# Altium schematic sheet MCU main_2.SchDoc: MAIN MCU 2
size A3; Date: 18 11 2014; Author: Rachid AKKOUCHE; CompanyName: MDI; DrawnBy: Rachid AKKOUCHE; Engineer: Rachid AKKOUCHE; Organization: RASoftware; Address1: 52-J03 rue de la crèche; Address2: 7710 MEAUX; DocumentNumber: BRA2013083002D; Revision: 3; SheetNumber: 2; SheetTotal: 11; Time: 01:38; ProjectName: CERES
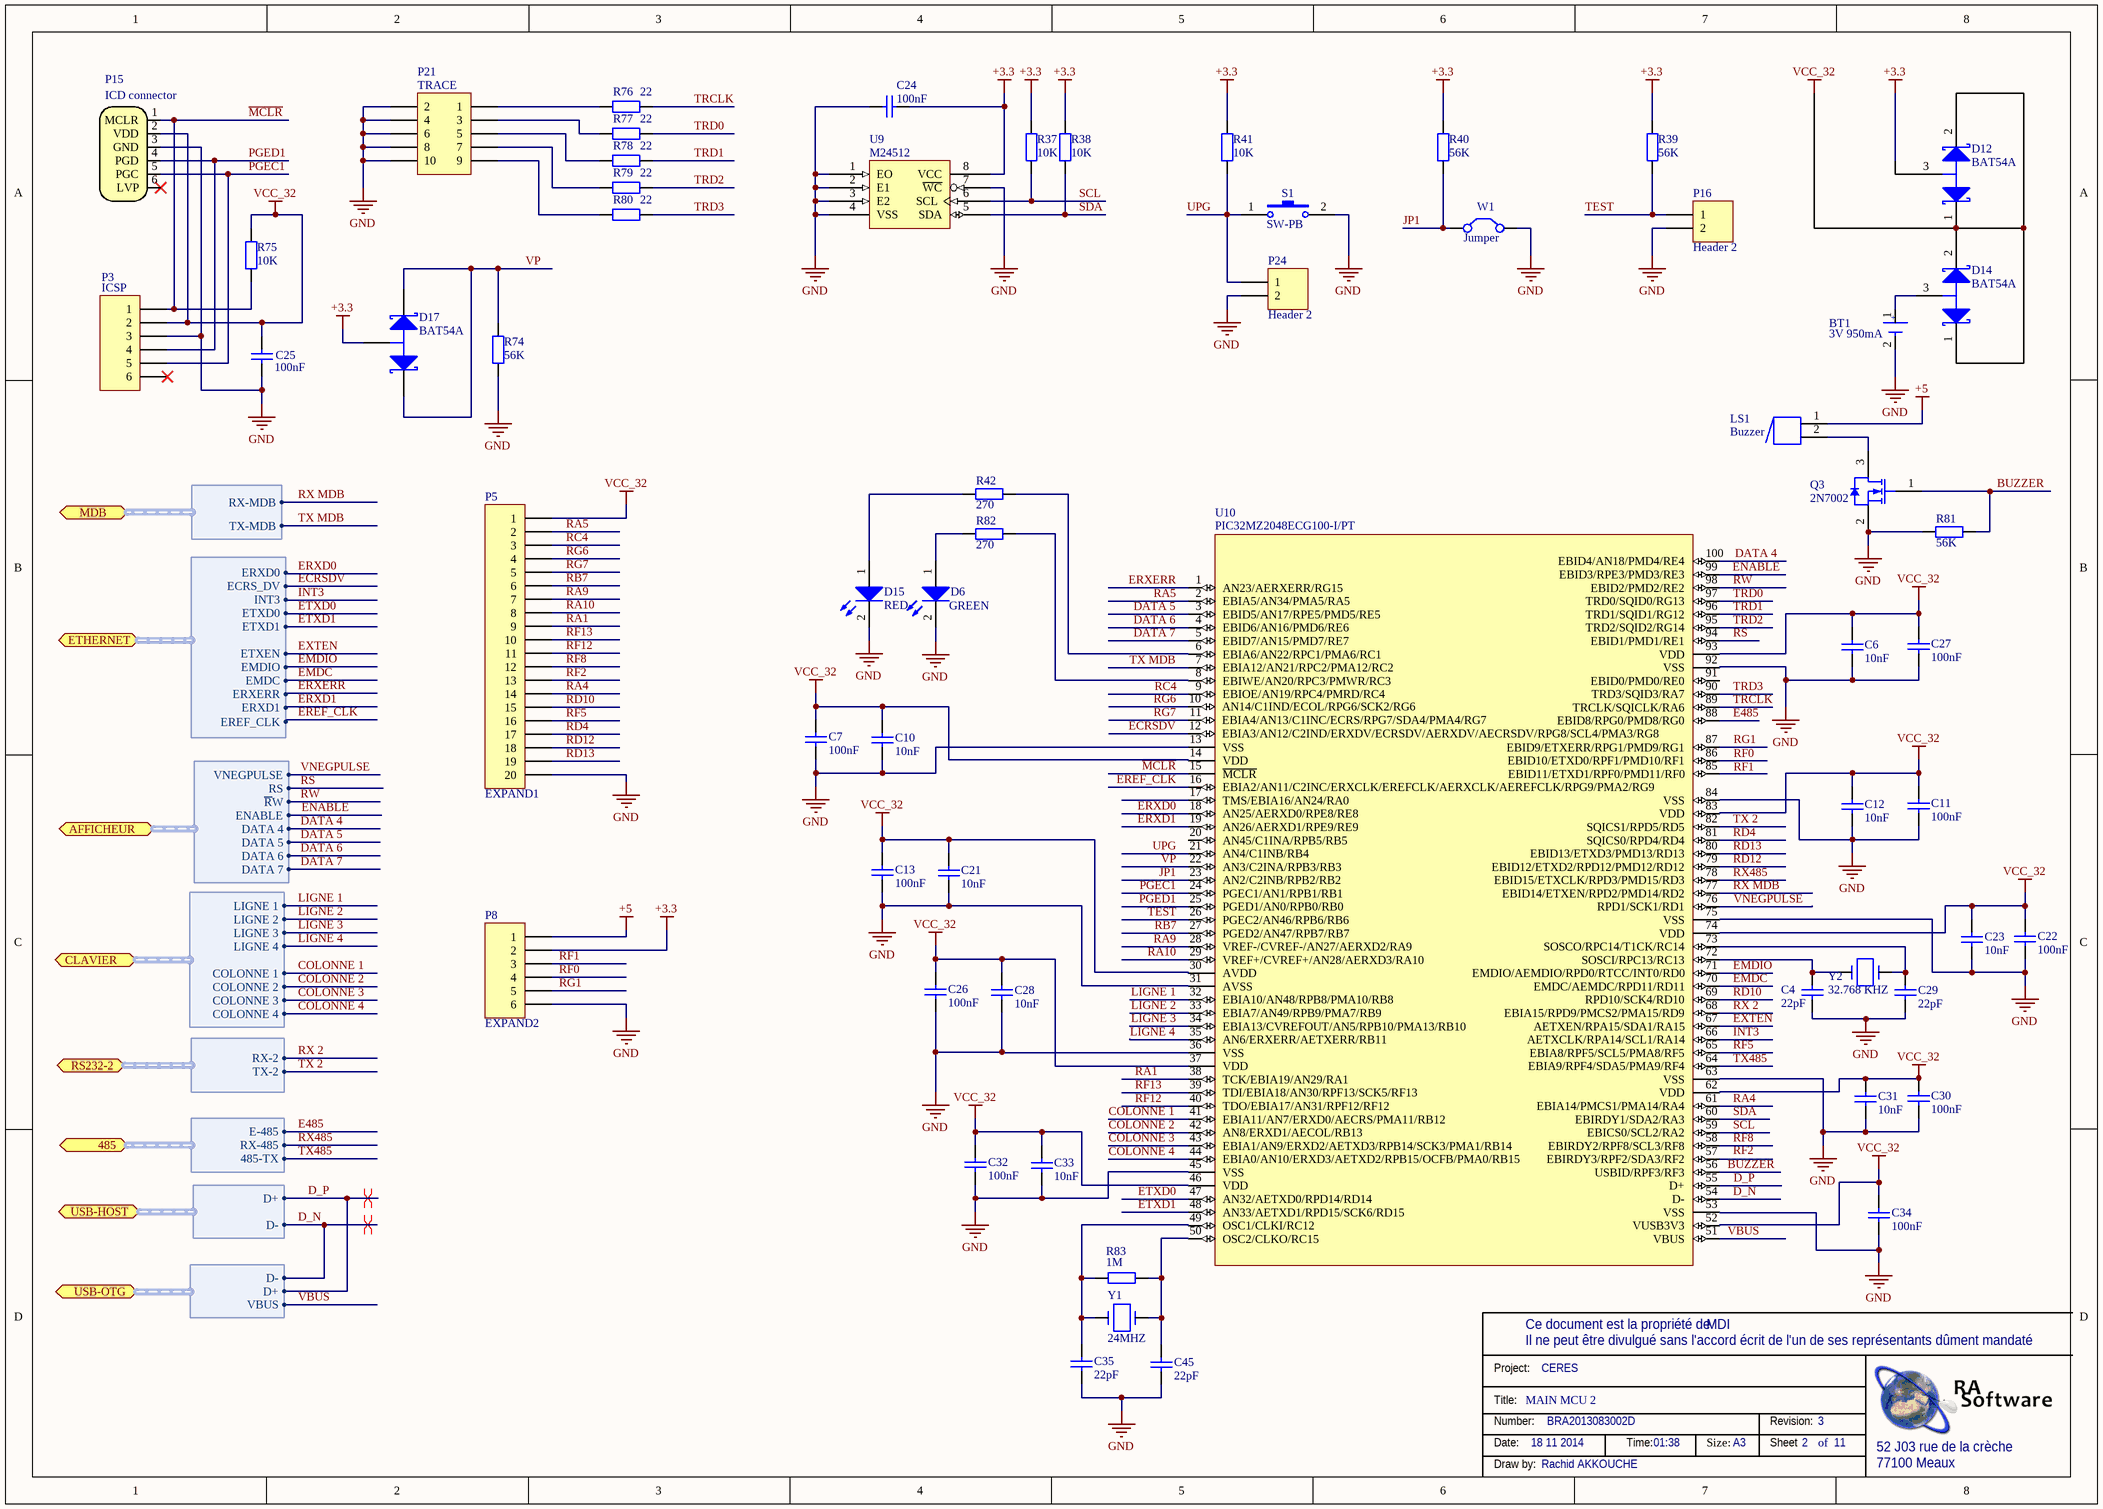
[diagram p0: MCU main_2.SchDoc]

## Parts
BT1  3V 950mA  [CR2477+SMTU]
C4  22pF  [C0805]
C6  10nF  [C0805]
C7  100nF  [C0805]
C10  10nF  [C0805]
C11  100nF  [C0805]
C12  10nF  [C0805]
C13  100nF  [C0805]
C21  10nF  [C0805]
C22  100nF  [C0805]
C23  10nF  [C0805]
C24  100nF  [C0805]
C25  100nF  [C0805]
C26  100nF  [C0805]
C27  100nF  [C0805]
C28  10nF  [C0805]
C29  22pF  [C0805]
C30  100nF  [C0805]
C31  10nF  [C0805]
C32  100nF  [C0805]
C33  10nF  [C0805]
C34  100nF  [C0805]
C35  22pF  [C0805]
C45  22pF  [C0805]
D6  Couleur: GREEN  [0603-LEDR]  (hidden comment: HSMG-C191)
D12  BAT54A  [SOT23]
D14  BAT54A  [SOT23]
D15  Couleur: RED  [0603-LEDR]  (hidden comment: HSMH-C190)
D17  BAT54A  [SOT23]
LS1  Buzzer  [Buzzer ABI-017-RC]
P3  M20-8770642  [M20_1X6]  (value not drawn)
P5  EXPAND1  [M20-2X10]
P8  EXPAND2  [M20_1X6]
P15  ICD connector  [TC2030]  (no BOM)
P16  Header 2  [M20_1X2]
P21  M20-8760542  [HE10_10PTS_CMS]  (value not drawn)
P24  Header 2  [M20_1X2]
Q3  2N7002  [SOT23]
R37  10K  [R0805]
R38  10K  [R0805]
R39  56K  [R0805]
R40  56K  [R0805]
R41  10K  [R0805]
R42  270  [R0805]
R74  56K  [R0805]
R75  10K  [R0805]
R76  22  [R0805]
R77  22  [R0805]
R78  22  [R0805]
R79  22  [R0805]
R80  22  [R0805]
R81  56K  [R0805]
R82  270  [R0805]
R83  1M  [R0805]
S1  SW-PB  [EVQQ2Y03W]
U9  M24512  [SOIC8]
U10  PIC32MZ2048ECG100-I/PT  [TQFP100pt]
W1  Jumper  [M20_1X2]
Y1  24MHZ  [HC49SD]
Y2  32.768 KHZ  [86SMX]

## Ports
485 (harness EIA-485), AFFICHEUR (harness IO DISPLAY), CLAVIER (harness KEYBOARD), ETHERNET (harness ETHERNET), MDB (harness MDB), RS232-2 (harness RS232_2), USB-HOST (harness USB-HOST), USB-OTG (harness USG-OTG)

## Harnesses
ETHERNET: ETXEN, ETXD0, ETXD1, INT3, EMDIO, EMDC, ECRS_DV, ERXERR, ERXD0, ERXD1, EREF_CLK
KEYBOARD: COLONNE 1, COLONNE 2, COLONNE 3, COLONNE 4, LIGNE 1, LIGNE 2, LIGNE 3, LIGNE 4
MDB: TX-MDB, RX-MDB
RS232_2: TX-2, RX-2
EIA-485: 485-TX, RX-485, E-485
USB-HOST: D-, D+
USG-OTG: D-, D+, VBUS
IO DISPLAY: DATA 4, DATA 5, DATA 6, DATA 7, ENABLE, ~{R}W, RS, VNEGPULSE

## Nets
+3.3: C24.1 D12.3(A) D17.3(A) P8.2 R37.2 R38.2 R39.2 R40.2 R41.2 U9.8(VCC)
+5: LS1.1 P8.1
GND: BT1.2 C4.2 C6.1 C7.1 C10.1 C11.1 C12.1 C13.1 C21.1 C22.1 C23.1 C24.2 C25.1 C26.1 C27.1 C28.1 C29.2 C30.1 C31.1 C32.1 C33.1 C34.1 C35.2 C45.2 D6.2(K) D15.2(K) P3.3 P5.20 P8.6 P15.3(GND) P16.2 P21.2 P21.4 P21.6 P21.8 P21.10 P24.2 Q3.2(S) R74.1 R81.1 S1.2 U9.1(EO) U9.2(E1) U9.3(E2) U9.4(VSS) U9.7(~{WC}) U10.13(VSS) U10.31(AVSS) U10.36(VSS) U10.45(VSS) U10.53(VSS) U10.63(VSS) U10.75(VSS) U10.84(VSS) U10.92(VSS) W1.2(C2)
VCC_32: C6.2 C7.2 C10.2 C11.2 C12.2 C13.2 C21.2 C22.2 C23.2 C25.2 C26.2 C27.2 C28.2 C30.2 C31.2 C32.2 C33.2 C34.2 D12.1(K1) D12.2(K2) D14.1(K1) D14.2(K2) P3.2 P5.1 P15.2(VDD) R75.2 U10.14(VDD) U10.30(AVDD) U10.37(VDD) U10.46(VDD) U10.52(VUSB3V3) U10.62(VDD) U10.74(VDD) U10.83(VDD) U10.93(VDD)
BUZZER: Q3.1(G) R81.2 U10.56(USBID/RPF3/RF3)
COLONNE 1: U10.41(EBIA11/AN7/ERXD0/AECRS/PMA11/RB12) ; port CLAVIER.COLONNE 1
COLONNE 2: U10.42(AN8/ERXD1/AECOL/RB13) ; port CLAVIER.COLONNE 2
COLONNE 3: U10.43(EBIA1/AN9/ERXD2/AETXD3/RPB14/SCK3/PMA1/RB14) ; port CLAVIER.COLONNE 3
COLONNE 4: U10.44(EBIA0/AN10/ERXD3/AETXD2/RPB15/OCFB/PMA0/RB15) ; port CLAVIER.COLONNE 4
D_N: U10.54(D-) ; port USB-HOST.D-, port USB-OTG.D-
D_P: U10.55(D+) ; port USB-HOST.D+, port USB-OTG.D+
DATA 4: U10.100(EBID4/AN18/PMD4/RE4) ; port AFFICHEUR.DATA 4
DATA 5: U10.3(EBID5/AN17/RPE5/PMD5/RE5) ; port AFFICHEUR.DATA 5
DATA 6: U10.4(EBID6/AN16/PMD6/RE6) ; port AFFICHEUR.DATA 6
DATA 7: U10.5(EBID7/AN15/PMD7/RE7) ; port AFFICHEUR.DATA 7
E485: U10.88(EBID8/RPG0/PMD8/RG0) ; port 485.E-485
ECRSDV: U10.12(EBIA3/AN12/C2IND/ERXDV/ECRSDV/AERXDV/AECRSDV/RPG8/SCL4/PMA3/RG8) ; port ETHERNET.ECRS_DV
EMDC: U10.70(EMDC/AEMDC/RPD11/RD11) ; port ETHERNET.EMDC
EMDIO: U10.71(EMDIO/AEMDIO/RPD0/RTCC/INT0/RD0) ; port ETHERNET.EMDIO
ENABLE: U10.99(EBID3/RPE3/PMD3/RE3) ; port AFFICHEUR.ENABLE
EREF_CLK: U10.16(EBIA2/AN11/C2INC/ERXCLK/EREFCLK/AERXCLK/AEREFCLK/RPG9/PMA2/RG9) ; port ETHERNET.EREF_CLK
ERXD0: U10.18(AN25/AERXD0/RPE8/RE8) ; port ETHERNET.ERXD0
ERXD1: U10.19(AN26/AERXD1/RPE9/RE9) ; port ETHERNET.ERXD1
ERXERR: U10.1(AN23/AERXERR/RG15) ; port ETHERNET.ERXERR
ETXD0: U10.47(AN32/AETXD0/RPD14/RD14) ; port ETHERNET.ETXD0
ETXD1: U10.48(AN33/AETXD1/RPD15/SCK6/RD15) ; port ETHERNET.ETXD1
EXTEN: U10.67(AETXEN/RPA15/SDA1/RA15) ; port ETHERNET.ETXEN
INT3: U10.66(AETXCLK/RPA14/SCL1/RA14) ; port ETHERNET.INT3
JP1: R40.1 U10.23(AN2/C2INB/RPB2/RB2) W1.1(C1)
LIGNE 1: U10.32(EBIA10/AN48/RPB8/PMA10/RB8) ; port CLAVIER.LIGNE 1
LIGNE 2: U10.33(EBIA7/AN49/RPB9/PMA7/RB9) ; port CLAVIER.LIGNE 2
LIGNE 3: U10.34(EBIA13/CVREFOUT/AN5/RPB10/PMA13/RB10) ; port CLAVIER.LIGNE 3
LIGNE 4: U10.35(AN6/ERXERR/AETXERR/RB11) ; port CLAVIER.LIGNE 4
~{MCLR}: P3.1 P15.1(MCLR) R75.1 U10.15(~{MCLR})
PGEC1: P3.5 P15.5(PGC) U10.24(PGEC1/AN1/RPB1/RB1)
PGED1: P3.4 P15.4(PGD) U10.25(PGED1/AN0/RPB0/RB0)
~{R}W: U10.98(EBID2/PMD2/RE2) ; port AFFICHEUR.~{R}W
RA1: P5.9 U10.38(TCK/EBIA19/AN29/RA1)
RA4: P5.14 U10.61(EBIA14/PMCS1/PMA14/RA4)
RA5: P5.2 U10.2(EBIA5/AN34/PMA5/RA5)
RA9: P5.7 U10.28(VREF-/CVREF-/AN27/AERXD2/RA9)
RA10: P5.8 U10.29(VREF+/CVREF+/AN28/AERXD3/RA10)
RB7: P5.6 U10.27(PGED2/AN47/RPB7/RB7)
RC4: P5.3 U10.9(EBIOE/AN19/RPC4/PMRD/RC4)
RD4: P5.17 U10.81(SQICS0/RPD4/RD4)
RD10: P5.15 U10.69(RPD10/SCK4/RD10)
RD12: P5.18 U10.79(EBID12/ETXD2/RPD12/PMD12/RD12)
RD13: P5.19 U10.80(EBID13/ETXD3/PMD13/RD13)
RF0: P8.4
RF1: P8.3
RF2: P5.13
RF5: P5.16 U10.65(EBIA8/RPF5/SCL5/PMA8/RF5)
RF8: P5.12 U10.58(EBIRDY2/RPF8/SCL3/RF8)
RF12: P5.11 U10.40(TDO/EBIA17/AN31/RPF12/RF12)
RF13: P5.10 U10.39(TDI/EBIA18/AN30/RPF13/SCK5/RF13)
RG1: P8.5 U10.87(EBID9/ETXERR/RPG1/PMD9/RG1)
RG6: P5.4 U10.10(AN14/C1IND/ECOL/RPG6/SCK2/RG6)
RG7: P5.5 U10.11(EBIA4/AN13/C1INC/ECRS/RPG7/SDA4/PMA4/RG7)
RS: U10.94(EBID1/PMD1/RE1) ; port AFFICHEUR.RS
RX485: U10.78(EBID15/ETXCLK/RPD3/PMD15/RD3) ; port 485.RX-485
RX 2: U10.68(EBIA15/RPD9/PMCS2/PMA15/RD9) ; port RS232-2.RX-2
RX MDB: U10.77(EBID14/ETXEN/RPD2/PMD14/RD2) ; port MDB.RX-MDB
SCL: R37.1 U9.6(SCL) U10.59(EBICS0/SCL2/RA2)
SDA: R38.1 U9.5(SDA) U10.60(EBIRDY1/SDA2/RA3)
TEST: P16.1 R39.1 U10.26(PGEC2/AN46/RPB6/RB6)
TRCLK: R76.1 U10.89(TRCLK/SQICLK/RA6)
TRD0: R77.1 U10.97(TRD0/SQID0/RG13)
TRD1: R78.1 U10.96(TRD1/SQID1/RG12)
TRD2: R79.1 U10.95(TRD2/SQID2/RG14)
TRD3: R80.1 U10.90(TRD3/SQID3/RA7)
TX485: U10.64(EBIA9/RPF4/SDA5/PMA9/RF4) ; port 485.485-TX
TX 2: U10.82(SQICS1/RPD5/RD5) ; port RS232-2.TX-2
TX MDB: U10.7(EBIA12/AN21/RPC2/PMA12/RC2) ; port MDB.TX-MDB
UPG: P24.1 R41.1 S1.1 U10.21(AN4/C1INB/RB4)
VBUS: U10.51(VBUS) ; port USB-OTG.VBUS
VNEGPULSE: U10.76(RPD1/SCK1/RD1) ; port AFFICHEUR.VNEGPULSE
VP: D17.1(K1) D17.2(K2) R74.2 U10.22(AN3/C2INA/RPB3/RB3)
NetBT1_1: BT1.1(+) D14.3(A)
NetC4_1: C4.1 U10.72(SOSCI/RPC13/RC13) Y2.2
NetC29_1: C29.1 U10.73(SOSCO/RPC14/T1CK/RC14) Y2.1
NetC35_1: C35.1 R83.2 U10.49(OSC1/CLKI/RC12) Y1.1
NetC45_1: C45.1 R83.1 U10.50(OSC2/CLKO/RC15) Y1.2
NetD6_1: D6.1(A) R82.1
NetD15_1: D15.1(A) R42.1
NetLS1_2: LS1.2 Q3.3(D)
NetP21_1: P21.1 R76.2
NetP21_3: P21.3 R77.2
NetP21_5: P21.5 R78.2
NetP21_7: P21.7 R79.2
NetP21_9: P21.9 R80.2
NetR42_2: R42.2 U10.6(EBIA6/AN22/RPC1/PMA6/RC1)
NetR82_2: R82.2 U10.8(EBIWE/AN20/RPC3/PMWR/RC3)

Not connected (* = marked no-connect by the designer): P3 6*; P15 6(LVP)*; U10 17(TMS/EBIA16/AN24/RA0) 20(AN45/C1INA/RPB5/RB5) 57(EBIRDY3/RPF2/SDA3/RF2) 85(EBID11/ETXD1/RPF0/PMD11/RF0) 86(EBID10/ETXD0/RPF1/PMD10/RF1) 91(EBID0/PMD0/RE0)

## Layout directives
differential pair: D_N, D_P

## Notes on the sheet
- Labels drawn without touching a wire or pin: RF0, RF1, RF2
- Ce document est la propriété de
- Project:
- Il ne peut être divulgué sans l'accord écrit de l'un de ses représentants dûment mandaté
- Title:
- Number:
- Date:
- Time:
- Size:
- A3
- Revision:
- Sheet
- of
- 52 J03 rue de la crèche
- Draw by:
- 77100 Meaux
- (in symbol Header 5X2) TRACE
- (in symbol Header 6) ICSP

## Library data of the parts
BT1 = Batterie: Manufacturer: RENATA; Manufacturer Part Number: CR2477N; Supplier 1: Farnell; Supplier Part Number 1: 4199200; RoHS: NA; Pricing 1: 1=2,66, 10=2,24, 100=1,98 (EUR); ComponentLink1URL: http://www.farnell.com/datasheets/8557.pdf; ComponentLink1Description: http://www.farnell.com/datasheets/8557.pdf; ComponentLink2URL: http://www.farnell.com/datasheets/1732059.pdf; ComponentLink2Description: http://www.farnell.com/datasheets/1732059.pdf; ComponentLink3URL: http://www.farnell.com/datasheets/1441997.pdf; ComponentLink3Description: http://www.farnell.com/datasheets/1441997.pdf; Supplier 2: Farnell; Supplier Part Number 2: 1216357; Pricing 2: 1=1,99, 25=1,76, 100=1,68, 250=1,59 (EUR); ComponentLink4URL: http://www.ryston.cz/windows-1250/renatabh.htm; ComponentLink4Description: http://www.ryston.cz/windows-1250/renatabh.htm; ComponentLink5URL: http://www.farnell.com/datasheets/1678381.pdf; ComponentLink5Description: http://www.farnell.com/datasheets/1678381.pdf
C4 C29 C35 C45 = Cap 0805 22pF: Capacitor; Manufacturer: YAGEO; Manufacturer Part Number: CC0805JRNPO9BN220; Supplier 1: Farnell; Supplier Part Number 1: 1816807; RoHS: YES; Pricing 1: 1=0,019, 25=0,016, 50=0,014, 100=0,011, 200=0,009, 1000=0,008 (EUR); ComponentLink1URL: http://www.farnell.com/datasheets/1132289.pdf; ComponentLink1Description: http://www.farnell.com/datasheets/1132289.pdf; Stock 1: 154
C6 C10 C12 C21 C23 C28 C31 C33 = Cap 0805 10nF: Capacitor; Manufacturer: AVX; Manufacturer Part Number: 0402YC103KAT2A; Unit: pcs; SuppliedAmount: 0; MinAmount: 200; Multiples: 100; Type de condensateur: céramique; Tye de condensateur: MLCC; Tension de travail: 16V; Diélectrique: X7R; Tolérance: ±10%; Montage: SMD; Boîtier: 0402; Température de travail: -55...125°C; Supplier 1: TME; Supplier Part Number 1: 0402YC103KAT2A; Category: Condensateurs MLCC SMD 0402; Stock: 41500; Weight: 0,014; Price Type: NET; Capacité: 10nF; Fabricant: AVX; ComponentLink1URL: http://www.tme.eu/fr/details/0402yc103kat2a/condensateurs-mlcc-smd-0402/avx/; ComponentLink1Description: http://www.tme.eu/fr/details/0402yc103kat2a/condensateurs-mlcc-smd-0402/avx/
C7 C11 C13 C22 C24-C27 C30 C32 C34 = Cap 0805 100nF: Capacitor; Manufacturer: MULTICOMP; Manufacturer Part Number: MCCA000296; Supplier 1: Farnell; Supplier Part Number 1: 1759167; Pricing 1: 100=0,01, 500=0,008, 1000=0,006, 4000=0,005 (EUR); ComponentLink1URL: http://www.farnell.com/datasheets/1520827.pdf; ComponentLink1Description: http://www.farnell.com/datasheets/1520827.pdf
D6 = HSMH-C190: Surface Mount Chip LED, Green
D12 D14 D17 = BAT54A: Schottky Barrier Double Diode; Manufacturer: FAIRCHILD SEMICONDUCTOR; Courant, If moy.: 200; Tension, Vrrm: 30; Tension, Vf max..: 320; Temps trr max.: 5; Courant, Ifs max.: 600; Température d'utilisation min: -55; Température de fonctionnement max..: 150; Type de boîtier diode: SOT-23; Nombre de broches: 3; SVHC: No SVHC (20-Jun-2013); Configuration diode: Double anode commune; Courant, If, Vf: 1; Marquage, CMS: L42; Température de fonctionnement: -55°C à +150; Type de terminaison: SMD; Supplier 1: Farnell; Supplier Part Number 1: 1228222; Manufacturer Part Number: BAT54A; RoHS: YES; Pricing 1: 5=0,084, 25=0,082, 100=0,036, 1000=0,032, 3000=0,03 (EUR); Diode Type: Schottky; MSL: MSL 1 - Illimité; Température, Tj max..: 150; Type de boîtier: SOT-23; courant Ifsm: 600; ComponentLink1URL: http://www.farnell.com/datasheets/1718084.pdf; ComponentLink1Description: http://www.farnell.com/datasheets/1718084.pdf; ComponentLink2URL: http://www.farnell.com/datasheets/410597.pdf; ComponentLink2Description: http://www.farnell.com/datasheets/410597.pdf
D15 = HSMH-C190: Surface Mount Chip LED, Red; Manufacturer: AVAGO TECHNOLOGIES; Manufacturer Part Number: HSMH-C190.; Taille de lampe: 0.8mm x 1; Couleur de LED: Rouge; Intensité lumineuse: 17; Angle, vision: 170°; Courant, direct, If: 20; Tension, direct à  If: 1.8; Montage LED: CMS; Forme de lentille: Rectangulaire; Longueur d'onde typ.: 626; SVHC: No SVHC (19-Dec-2012); Dissipation de puissance: 65; Intensité lumineuse min. à  If: 2.8; Intensité lumineuse typique: 10; Largeur (externe): 0.8; Longueur d'onde dominante: 639; Longueur d'onde, crête: 630; Longueur/hauteur: 1.6; Matière: AlGaAs; Nombre de broches: 2; Orientation de montage opto: Dessus; Orientation sortie de lumière: Top Emitting; Température de fonctionnement: -30°C à +85; Température de fonctionnement max..: 85; Température, stockage min.: -40; Température d'utilisation min: -30; Tension, Vf max..: 2.6; Tension, Vf min.: 2.1; Type de LED: Standard; Supplier 1: Farnell; Supplier Part Number 1: 8554641; RoHS: YES; Stock 1: 13902; Pricing 1: 5=0,06, 25=0,059, 100=0,057, 250=0,052, 500=0,047 (EUR); MSL: MSL 2A - 4 semaines; Couleur, LED: Rouge; Profondeur: 0.8; Température, stockage max..: 85; Tension, Vf typ.: 1.8; ComponentLink1URL: http://www.farnell.com/datasheets/313031.pdf; ComponentLink1Description: http://www.farnell.com/datasheets/313031.pdf; ComponentLink2URL: http://www.farnell.com/datasheets/55927.pdf; ComponentLink2Description: http://www.farnell.com/datasheets/55927.pdf
LS1 = Buzzer: Magnetic Transducer Buzzer; Manufacturer: PRO SIGNAL; Manufacturer Part Number: ABI-017-RC; Tension, alimentation min.: 4; Tension, alimentation max..: 7; Courant de fonctionnement max..: 30; Niveau de bruit: 88; Distance, niveau sonore: 10; Fréquence de résonance: 2.4; Largeur (externe): 12.8; SVHC: No SVHC (19-Dec-2012); Poids: 2; Profondeur: 7.1; Température de fonctionnement max..: 70; Température d'utilisation min: -20; Supplier 1: Farnell; Supplier Part Number 1: 1504107; RoHS: YES; Pricing 1: 1=2,51, 10=2,23, 100=2,03, 250=1,88 (EUR); Transducer Function: Buzzer; Hauteur, dimension externe: 12.8; Consommation de courant: 30; Courant: 30; Hauteur: 12.8; Longueur/hauteur: 12.8; ComponentLink1URL: http://www.farnell.com/datasheets/1671249.pdf; ComponentLink1Description: http://www.farnell.com/datasheets/1671249.pdf; ComponentLink2URL: http://www.farnell.com/datasheets/1662050.pdf; ComponentLink2Description: http://www.farnell.com/datasheets/1662050.pdf
P3 = Header 6: Header, 6-Pin; Manufacturer: HARWIN; Type de connecteur: Contact fil-à-carte; Série: M20; Terminaison du contact: Montage en surface vertical; Genre: Embase; Nombre de contacts: 6; Nombre de rangées: 1; Pas: 2.54; Plaquage du contact: Or; Matériau du contact: Laiton; SVHC: No SVHC (19-Dec-2012); Supplier 1: Farnell; Supplier Part Number 1: 1517384; Manufacturer Part Number: M20-8770642; RoHS: YES; Stock 1: 3471; Pricing 1: 10=0,69, 20=0,66, 50=0,62, 100=0,6, 250=0,56, 500=0,49 (EUR); Pas, rang: 2.54; ComponentLink1URL: http://www.farnell.com/datasheets/1089524.pdf; ComponentLink1Description: http://www.farnell.com/datasheets/1089524.pdf; ComponentLink2URL: http://www.farnell.com/datasheets/5481.pdf; ComponentLink2Description: http://www.farnell.com/datasheets/5481.pdf
P5 = Header 20: Header, 20-Pin; LatestRevisionDate: 17-Jul-2002; LatestRevisionNote: Re-released for DXP Platform.; Publisher: Altium Limited
P8 = Header 6: Header, 6-Pin; LatestRevisionDate: 17-Jul-2002; LatestRevisionNote: Re-released for DXP Platform.; Publisher: Altium Limited
P15 = TC2030-MCP-NL: Conector par ICD
P16 P24 = Header 2: Header, 2-Pin; Manufacturer: HARWIN; Manufacturer Part Number: M20-8770242; Product Range: HARWIN - M20-87 Series; Terminaison du contact: PCB; Genre: Connecteur mâle; Nombre de contacts: 2; Nombre de rangées: 1; Pas: 2.54; Plaquage du contact: Or; Matériau du contact: Laiton; SVHC: No SVHC (20-Jun-2013); LatestRevisionDate: 17-Jul-2002; LatestRevisionNote: Re-released for DXP Platform.; Publisher: Altium Limited; Supplier 1: Farnell; Supplier Part Number 1: 1895211; RoHS: YES; Pricing 1: 10=0,137, 20=0,136, 50=0,135, 100=0,133, 250=0,128, 500=0,12 (EUR); ComponentLink1URL: http://www.farnell.com/cad/1330190.pdf; ComponentLink1Description: http://www.farnell.com/cad/1330190.pdf
P21 = Header 5X2: Header, 5-Pin, Dual row; Manufacturer: HARWIN; Type de connecteur: Contact fil-à-carte; Série: M20; Terminaison du contact: Montage en surface vertical; Genre: Embase; Nombre de contacts: 10; Nombre de rangées: 2; Pas: 2.54; Plaquage du contact: Or; Matériau du contact: Laiton; SVHC: No SVHC (19-Dec-2012); Supplier 1: Farnell; Supplier Part Number 1: 1517390; Manufacturer Part Number: M20-8760542; RoHS: YES; Stock 1: 4126; Pricing 1: 10=0,89, 20=0,75, 50=0,66, 100=0,55, 250=0,54, 500=0,53 (EUR); Pas, rang: 2.54; ComponentLink1URL: http://www.farnell.com/datasheets/1089515.pdf; ComponentLink1Description: http://www.farnell.com/datasheets/1089515.pdf; ComponentLink2URL: http://www.farnell.com/datasheets/5481.pdf; ComponentLink2Description: http://www.farnell.com/datasheets/5481.pdf
Q3 = 2N7002: N-channel Enhancement Mode Field-effect Transistor; Manufacturer: STMICROELECTRONICS; Published: 17-Sep-2003; LatestRevisionDate: 12-Dec-2006; LatestRevisionNote: IPC-7351 Footprint Added.; DatasheetVersion: 27-Jul-2000; PackageVersion: May-1999; PackageReference: SOT23; Publisher: Altium Limited; PackageDescription: 3-Pin SOT-23 Package 0.95 mm Pitch, 2.3 mm Lead Span; ComponentLink1Description: Manufacturer Link; ComponentLink1URL: http://www.semiconductors.philips.com/; ComponentLink2Description: Datasheet; ComponentLink2URL: http://www.semiconductors.philips.com/acrobat/datasheets/2N7002_4.pdf; Supplier 1: Farnell; Supplier Part Number 1: 9512608; Manufacturer Part Number: 2N7002; RoHS: YES; Pricing 1: 1=0,56, 25=0,48, 100=0,44, 250=0,43, 1000=0,42 (EUR); ComponentLink3URL: http://www.st.com/web/en/resource/technical/document/datasheet/CD00005134.pdf; ComponentLink3Description: http://www.st.com/web/en/resource/technical/document/datasheet/CD00005134.pdf
R37 R38 R41 R75 = Resistor 0805 10K: Resistor; Manufacturer: MULTICOMP; Manufacturer Part Number: MC0.1W08051%10KFR; Product Range: MULTICOMP - MC Series; Résistance: 10; Puissance: 100; Tolérance de résistance: ± 1%; Type de boîtier de résistance: 0805; Type de résistance: Couche épaisse; Coefficient de température: ± 100; Tension: 150; Type de packaging: Full Reel; Resistor Mounting: CMS; Supplier 1: Farnell; RoHS: YES; Pricing 1: 5000=0,001 (EUR); MSL: MSL 1 - Illimité; ComponentLink1URL: http://www.farnell.com/datasheets/1716700.pdf; ComponentLink1Description: http://www.farnell.com/datasheets/1716700.pdf; Supplier Part Number 1: 2129195
R39 R40 R74 R81 = Resistor 0805 56K: Resistor; Manufacturer: MULTICOMP; Manufacturer Part Number: MC0.1W08051%56KFR; Product Range: MULTICOMP - MC Series; Résistance: 56; Puissance: 100; Tolérance de résistance: ± 1%; Type de boîtier de résistance: 0805; Type de résistance: Couche épaisse; Coefficient de température: ± 100; Tension: 150; Type de packaging: Full Reel; Resistor Mounting: CMS; Resistor Terminals: (Non Disponible); Supplier 1: Farnell; RoHS: YES; Pricing 1: 5000=0,001 (EUR); MSL: (Non Applicable); ComponentLink1URL: http://www.farnell.com/datasheets/1716700.pdf; ComponentLink1Description: http://www.farnell.com/datasheets/1716700.pdf; Supplier Part Number 1: 2129258
R42 R82 = Resistor 0805 1K: Resistor; Manufacturer: MULTICOMP; Manufacturer Part Number: MC0.1W08051%1KFR; Product Range: MULTICOMP - MC Series; Résistance: 1; Puissance: 100; Tolérance de résistance: ± 1%; Type de boîtier de résistance: 0805; Type de résistance: Couche épaisse; Coefficient de température: ± 100; Tension: 150; Type de packaging: Full Reel; Resistor Mounting: CMS; Supplier 1: Farnell; RoHS: YES; Pricing 1: 5000=0,001 (EUR); MSL: MSL 1 - Illimité; ComponentLink1URL: http://www.farnell.com/datasheets/1716700.pdf; ComponentLink1Description: http://www.farnell.com/datasheets/1716700.pdf; Supplier Part Number 1: 2129113
R76-R80 = Resistor 0805 22: Resistor; Manufacturer: MULTICOMP; Manufacturer Part Number: MC01W0805122R; Product Range: MULTICOMP - MC Series; Puissance: 100; Tolérance de résistance: ± 1%; Type de boîtier de résistance: 0805; Type de résistance: Couche épaisse; Coefficient de température: ± 200; Tension: 150; Type de packaging: Full Reel; SVHC: No SVHC (20-Jun-2013); Resistor Mounting: CMS; Supplier 1: Farnell; RoHS: YES; Pricing 1: 5000=0,001 (EUR); Résistance: 22; MSL: -; ComponentLink1URL: http://www.farnell.com/datasheets/1729047.pdf; ComponentLink1Description: http://www.farnell.com/datasheets/1729047.pdf; Supplier Part Number 1: 2128982
R83 = Resistor 0805 1M: Resistor
S1 = SW-PB: Switch; Manufacturer: PANASONIC; Published: 24-Mar-1999; LatestRevisionDate: 17-Jul-2002; LatestRevisionNote: Re-released for DXP Platform.; PackageReference: SPST-2; Publisher: Altium Limited; PackageDescription: Switch; 2 Leads; Supplier 1: Farnell; Supplier Part Number 1: 9962875; Manufacturer Part Number: EVQQ2Y03W; RoHS: YES; Pricing 1: 1=0,34, 50=0,27, 100=0,23 (EUR); ComponentLink1URL: http://www.farnell.com/datasheets/28111.pdf; ComponentLink1Description: http://www.farnell.com/datasheets/28111.pdf
U9 = M24512-MN: EEPROM 512K I2C; Manufacturer: STMICROELECTRONICS; Manufacturer Part Number: M24512-WMN6P; Supplier 1: Farnell; RoHS: YES; Pricing 1: 1=1,2, 10=1,08, 100=0,96 (EUR); ComponentLink1URL: http://www.st.com/st-web-ui/static/active/en/resource/technical/document/datasheet/CD00251873.pdf; ComponentLink1Description: http://www.st.com/st-web-ui/static/active/en/resource/technical/document/datasheet/CD00251873.pdf; ComponentLink2URL: http://www.farnell.com/cad/1550662.zip; ComponentLink2Description: http://www.farnell.com/cad/1550662.zip; Supplier Part Number 1: 1670818
U10 = PIC32MZ Embedded Connectivity: PIC32MZ2048ECG100; Manufacturer: Microchip Technology; Program Memory Type: Flash; A/D Bit Size: 12 bit; A/D Channels Available: 40; Data RAM Size: 512 kB; Data RAM Type: RAM; Interface Type: JTAG, I2C, PMP, SPI, SQI, UART, USB; Number of I/Os: 78 I/O; Program Memory Size: 2048 kB; Core: MIPS32 microAptiv MPU; Data Bus Width: 32 bit; Maximum Clock Frequency: 200 MHz; Number of Timers: 9 Timer; On-Chip DAC: Without DAC; Operating Supply Voltage: 2.2 V to 3.6 V; Processor Series: PIC32MZ EC; Product Status: New Product; Architecture: PIC32; Taille de mémoire programme: 2; Taille mémoire, RAM: 512; Vitesse de processeur: 200; Nombre d'E/S: 78; Type de boîtier MCU: TQFP; Nombre de broches: 100; Type d'interface embarquée: Ethernet, I2; Tension, alimentation min.: 2.2; Tension, alimentation max..: 3.6; Type de packaging: Unitaire; SVHC: No SVHC (16-Jun-2014); Nombre de timers: 9; Manufacturer Part Number: PIC32MZ2048ECG100-I/PT; RoHS: RoHS Compliant; Category: 32-bit Microcontrollers - MCU; Stock: 0; Package / Case: TQFP-100; Packaging: Tray; Brand: Microchip Technology; Mounting Style: SMD/SMT; Maximum Operating Temperature: + 85 C; Minimum Operating Temperature: - 40 C; Standard Pack Qty: 119; RoHS - Mouser: Y; Minimum Order Quantity: 1; Reeling: False; ComponentLink1URL: http://www.microchip.com/mymicrochip/filehandler.aspx?ddocname=en566815; ComponentLink1Description: http://www.microchip.com/mymicrochip/filehandler.aspx?ddocname=en566815; Supplier 1: Farnell; Supplier Part Number 1: 2387247; Stock 1: 219; Pricing 1: 1=8,81, 10=7,46, 25=7,41, 50=7,36, 100=7,31 (EUR); MSL: MSL 1 - Illimité; ComponentLink2URL: http://www.farnell.com/datasheets/1789766.pdf; ComponentLink2Description: http://www.farnell.com/datasheets/1789766.pdf
W1 = Jumper: Jumper Wire; Manufacturer: HARWIN; Manufacturer Part Number: M20-8770242; Product Range: HARWIN - M20-87 Series; Terminaison du contact: PCB; Genre: Connecteur mâle; Nombre de contacts: 2; Nombre de rangées: 1; Pas: 2.54; Plaquage du contact: Or; Matériau du contact: Laiton; SVHC: No SVHC (20-Jun-2013); Published: 24-Mar-1999; LatestRevisionDate: 17-Jul-2002; LatestRevisionNote: Re-released for DXP Platform.; PackageReference: RAD-0.2; Publisher: Altium Limited; PackageDescription: Radial Cap, Thru-Hole; 2 Leads; 0.2 in Pin Spacing; Supplier 1: Farnell; Supplier Part Number 1: 1895211; RoHS: YES; Pricing 1: 10=0,137, 20=0,136, 50=0,135, 100=0,133, 250=0,128, 500=0,12 (EUR); ComponentLink1URL: http://www.farnell.com/cad/1330190.pdf; ComponentLink1Description: http://www.farnell.com/cad/1330190.pdf
Y1 = CRYSTAL 24MHZ: QUARTZ 24MHZ; Manufacturer: YIC; Unit: pcs; SuppliedAmount: 1000; MinAmount: 2; Multiples: 1; Type de résonateur: à quartz; Tolérance de résonateurs: ±30ppm; Puissance: 1mW; Montage: SMD; Boîtier: HC49SM; Stabilité dans le temps: ±5ppm/année; Supplier 1: TME; Supplier Part Number 1: 24.00M-SMDHC49S; Category: Resonateurs à quartz CMS; Stock: 1764; Pricing: 2=0,353, 10=0,211, 100=0,13, 1000=0,095 (EUR); Weight: 1,142; Price Type: NET; Fréquence: 24MHz; Fabricant: YIC; ComponentLink1URL: http://www.tme.eu/fr/details/24.00m-smdhc49s/resonateurs-a-quartz-cms/yic/; ComponentLink1Description: http://www.tme.eu/fr/details/24.00m-smdhc49s/resonateurs-a-quartz-cms/yic/
Y2 = CRYSTAL2: Manufacturer: FOX ELECTRONICS; Manufacturer Part Number: FPXLF080-20; Supplier 1: Farnell; Supplier Part Number 1: 2064009; RoHS: YES; Pricing 1: 1=1,92, 10=1,25, 100=0,95, 250=0,89, 500=0,79, 3000=0,491, 3000=0,442, 20000=0,427 (EUR); ComponentLink1URL: http://www.foxonline.com/pdfs/fpxlf.pdf; ComponentLink1Description: http://www.foxonline.com/pdfs/fpxlf.pdf